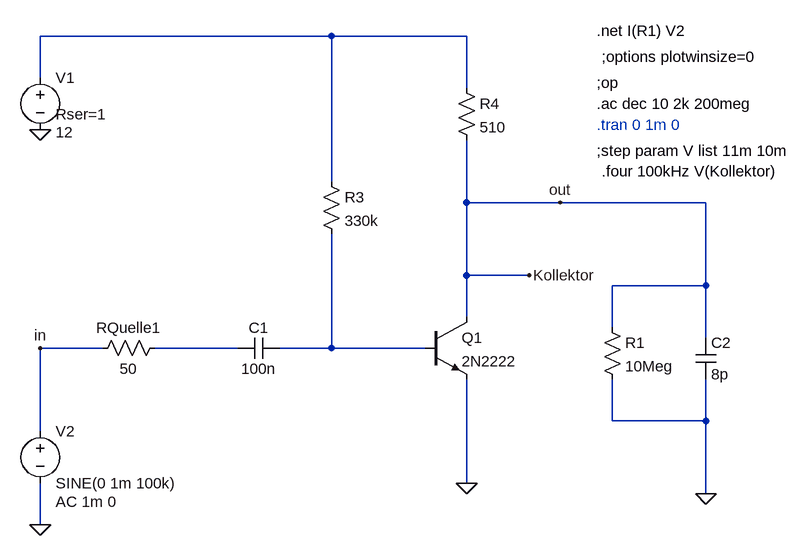
[diagram p0: schematic Versuch1-2.asc]
Versuch1-2.asc, the LTspice schematic file:
Version 4.1
SHEET 1 1548 680
WIRE 432 -432 -16 -432
WIRE 640 -432 432 -432
WIRE -16 -368 -16 -432
WIRE 640 -352 640 -432
WIRE 432 -208 432 -432
WIRE 640 -176 640 -272
WIRE 784 -176 640 -176
WIRE 1008 -176 784 -176
WIRE 640 -64 640 -176
WIRE 736 -64 640 -64
WIRE 1008 -48 1008 -176
WIRE 1008 -48 864 -48
WIRE 640 0 640 -64
WIRE 864 16 864 -48
WIRE 1008 32 1008 -48
WIRE 80 48 -16 48
WIRE 288 48 160 48
WIRE 432 48 432 -128
WIRE 432 48 352 48
WIRE 576 48 432 48
WIRE 864 160 864 96
WIRE 1008 160 1008 96
WIRE 1008 160 864 160
WIRE -16 176 -16 48
WIRE 640 256 640 96
WIRE 1008 272 1008 160
WIRE -16 320 -16 256
FLAG -16 320 0
FLAG -16 -288 0
FLAG 640 256 0
FLAG 1008 272 0
FLAG -16 48 in
FLAG 784 -176 out
FLAG 736 -64 Kollektor
SYMBOL voltage -16 160 R0
WINDOW 123 24 124 Left 2
WINDOW 39 0 0 Left 0
SYMATTR Value2 AC 1m 0
SYMATTR InstName V2
SYMATTR Value SINE(0 1m 100k)
SYMBOL res 176 32 R90
WINDOW 0 0 56 VBottom 2
WINDOW 3 32 56 VTop 2
SYMATTR InstName RQuelle1
SYMATTR Value 50
SYMBOL cap 352 32 R90
WINDOW 0 0 32 VBottom 2
WINDOW 3 32 32 VTop 2
SYMATTR InstName C1
SYMATTR Value 100n
SYMBOL res 416 -224 R0
SYMATTR InstName R3
SYMATTR Value 330k
SYMBOL res 624 -368 R0
SYMATTR InstName R4
SYMATTR Value 510
SYMBOL npn 576 0 R0
SYMATTR InstName Q1
SYMATTR Value 2N2222
SYMBOL voltage -16 -384 R0
WINDOW 3 24 100 Left 2
WINDOW 123 0 0 Left 0
WINDOW 39 24 72 Left 2
SYMATTR Value 12
SYMATTR SpiceLine Rser=1
SYMATTR InstName V1
SYMBOL res 848 0 R0
SYMATTR InstName R1
SYMATTR Value 10Meg
SYMBOL cap 992 32 R0
SYMATTR InstName C2
SYMATTR Value 8p
TEXT 840 -360 Left 2 !;op
TEXT 840 -328 Left 2 !.ac dec 10 2k 200meg
TEXT 840 -296 Left 2 ;.tran 0 1m 0
TEXT 840 -256 Left 2 !;step param V list 11m 10m
TEXT 848 -224 Left 2 !.four 100kHz V(Kollektor)
TEXT 848 -400 Left 2 !;options plotwinsize=0
TEXT 840 -440 Left 2 !.net I(R1) V2

The netlist it stands for:
* Versuch1-2.asc
V2 in 0 SINE(0 1m 100k) AC 1m 0
RQuelle1 N002 in 50
C1 N003 N002 100n
R3 N001 N003 330k
R4 N001 Kollektor 510
Q1 Kollektor N003 0 0 2N2222
V1 N001 0 12 Rser=1
R1 Kollektor 0 10Meg
C2 Kollektor 0 8p
.model NPN NPN
.model PNP PNP
.lib standard.bjt
;op
.ac dec 10 2k 200meg
* .tran 0 1m 0
;step param V list 11m 10m
.four 100kHz V(Kollektor)
;options plotwinsize=0
.net I(R1) V2
.backanno
.end